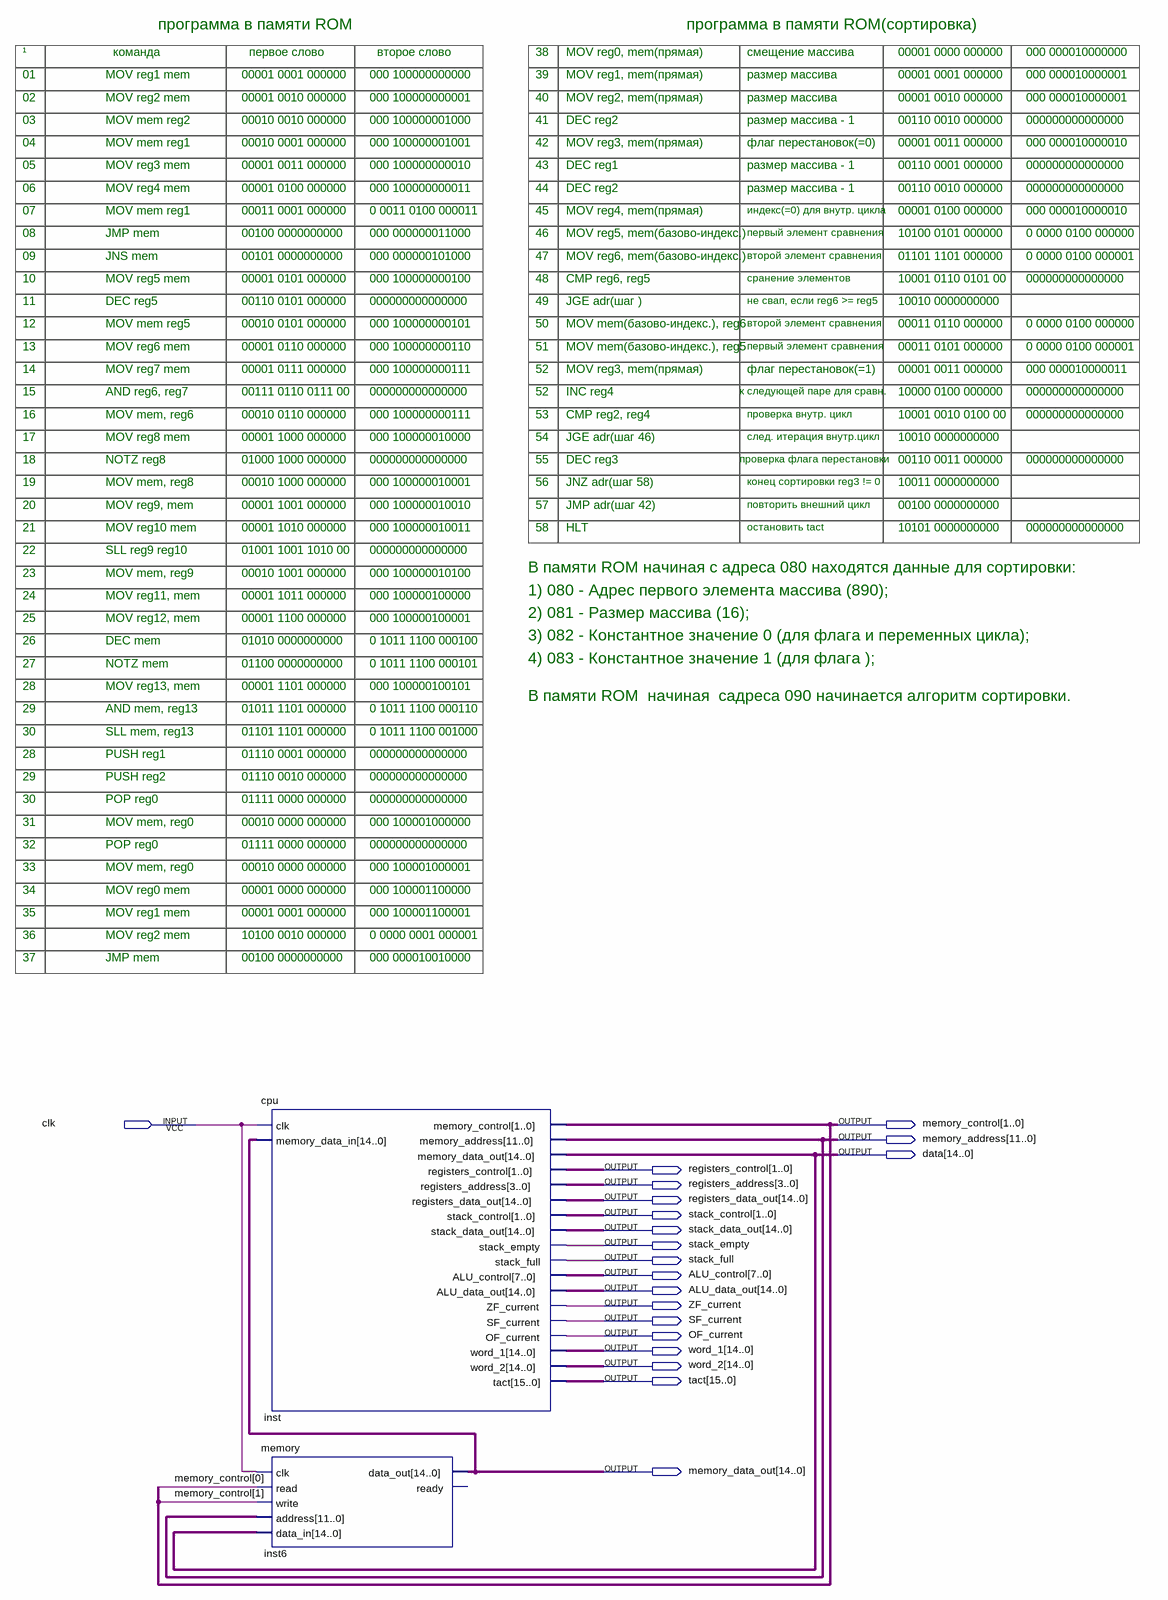
[diagram p0: schematic sheet]
// Quartus schematic principal.bdf as structural Verilog: 2 symbols, 20 pins
module principal (
  input  clk,
  output [1:0] memory_control,
  output [11:0] memory_address,
  output [14:0] data,
  output [1:0] registers_control,
  output [3:0] registers_address,
  output [14:0] registers_data_out,
  output [1:0] stack_control,
  output [14:0] stack_data_out,
  output stack_empty,
  output stack_full,
  output [7:0] ALU_control,
  output [14:0] ALU_data_out,
  output ZF_current,
  output SF_current,
  output OF_current,
  output [14:0] word_1,
  output [14:0] word_2,
  output [15:0] tact,
  output [14:0] memory_data_out
);

  cpu inst (
    .clk(clk), .memory_data_in(memory_data_out), .memory_control(memory_control),
    .memory_address(memory_address), .memory_data_out(data), .registers_control(registers_control),
    .registers_address(registers_address), .registers_data_out(registers_data_out),
    .stack_control(stack_control), .stack_data_out(stack_data_out), .stack_empty(stack_empty),
    .stack_full(stack_full), .ALU_control(ALU_control), .ALU_data_out(ALU_data_out), .ZF_current(ZF_current),
    .SF_current(SF_current), .OF_current(OF_current), .word_1(word_1), .word_2(word_2), .tact(tact));
  memory inst6 (
    .clk(clk), .read(memory_control[0]), .write(memory_control[1]), .address(memory_address), .data_in(data),
    .data_out(memory_data_out));  // open: ready

  // Notes on the sheet:
  //   программа в памяти ROM
  //   программа в памяти ROM(сортировка)
  //   ¹
  //   команда
  //   первое слово
  //   второе слово
  //   38
  //   MOV reg0, mem(прямая)
  //   смещение массива
  //   00001 0000 000000
  //   000 000010000000
  //   01
  //   MOV reg1 mem
  //   00001 0001 000000
  //   000 100000000000
  //   39
  //   MOV reg1, mem(прямая)
  //   размер массива
  //   00001 0001 000000
  //   000 000010000001
  //   02
  //   MOV reg2 mem
  //   00001 0010 000000
  //   000 100000000001
  //   40
  //   MOV reg2, mem(прямая)
  //   размер массива
  //   00001 0010 000000
  //   000 000010000001
  //   03
  //   MOV mem reg2
  //   00010 0010 000000
  //   000 100000001000
  //   41
  //   DEC reg2
  //   размер массива - 1
  //   00110 0010 000000
  //   000000000000000
  //   04
  //   MOV mem reg1
  //   00010 0001 000000
  //   000 100000001001
  //   42
  //   MOV reg3, mem(прямая)
  //   флаг перестановок(=0)
  //   00001 0011 000000
  //   000 000010000010
  //   05
  //   MOV reg3 mem
  //   00001 0011 000000
  //   000 100000000010
  //   43
  //   DEC reg1
  //   размер массива - 1
  //   00110 0001 000000
  //   000000000000000
  //   06
  //   MOV reg4 mem
  //   00001 0100 000000
  //   000 100000000011
  //   44
  //   DEC reg2
  //   размер массива - 1
  //   00110 0010 000000
  //   000000000000000
  //   07
  //   MOV mem reg1
  //   00011 0001 000000
  //   0 0011 0100 000011
  //   45
  //   MOV reg4, mem(прямая)
  //   индекс(=0) для внутр. цикла
  //   00001 0100 000000
  //   000 000010000010
  //   08
  //   JMP mem
  //   00100 0000000000
  //   000 000000011000
  //   46
  //   MOV reg5, mem(базово-индекс.)
  //   первый элемент сравнения
  //   10100 0101 000000
  //   0 0000 0100 000000
  //   09
  //   JNS mem
  //   00101 0000000000
  //   000 000000101000
  //   47
  //   MOV reg6, mem(базово-индекс.)
  //   второй элемент сравнения
  //   01101 1101 000000
  //   0 0000 0100 000001
  //   10
  //   MOV reg5 mem
  //   00001 0101 000000
  //   000 100000000100
  //   48
  //   CMP reg6, reg5
  //   сранение элементов
  //   10001 0110 0101 00
  //   000000000000000
  //   11
  //   DEC reg5
  //   00110 0101 000000
  //   000000000000000
  //   49
  //   JGE adr(шаг )
  //   не свап, если reg6 >= reg5
  //   10010 0000000000
  //   12
  //   MOV mem reg5
  //   00010 0101 000000
  //   000 100000000101
  //   50
  //   MOV mem(базово-индекс.), reg6
  //   второй элемент сравнения
  //   00011 0110 000000
  //   0 0000 0100 000000
  //   13
  //   MOV reg6 mem
  //   00001 0110 000000
  //   000 100000000110
  //   51
  //   MOV mem(базово-индекс.), reg5
  //   первый элемент сравнения
  //   00011 0101 000000
  //   0 0000 0100 000001
  //   14
  //   MOV reg7 mem
  //   00001 0111 000000
  //   000 100000000111
  //   52
  //   MOV reg3, mem(прямая)
  //   флаг перестановок(=1)
  //   00001 0011 000000
  //   000 000010000011
  //   15
  //   AND reg6, reg7
  //   00111 0110 0111 00
  //   000000000000000
  //   52
  //   INC reg4
  //   к следующей паре для сравн.
  //   10000 0100 000000
  //   000000000000000
  //   16
  //   MOV mem, reg6
  //   00010 0110 000000
  //   000 100000000111
  //   53
  //   CMP reg2, reg4
  //   проверка внутр. цикл
  //   10001 0010 0100 00
  //   000000000000000
  //   17
  //   MOV reg8 mem
  //   00001 1000 000000
  //   000 100000010000
  //   54
  //   JGE adr(шаг 46)
  //   след. итерация внутр.цикл
  //   10010 0000000000
  //   18
  //   NOTZ reg8
  //   01000 1000 000000
  //   000000000000000
  //   55
  //   DEC reg3
  //   проверка флага перестановки
  //   00110 0011 000000
  //   000000000000000
  //   19
  //   MOV mem, reg8
  //   00010 1000 000000
  //   000 100000010001
  //   56
  //   JNZ adr(шаг 58)
  //   конец сортировки reg3 != 0
  //   10011 0000000000
  //   20
  //   MOV reg9, mem
  //   00001 1001 000000
  //   000 100000010010
  //   57
  //   JMP adr(шаг 42)
  //   повторить внешний цикл
  //   00100 0000000000
  //   21
  //   MOV reg10 mem
  //   00001 1010 000000
  //   000 100000010011
  //   58
  //   HLT
  //   остановить tact
  //   10101 0000000000
  //   000000000000000
  //   22
  //   SLL reg9 reg10
  //   01001 1001 1010 00
  //   000000000000000
  //   В памяти ROM начиная с адреса 080 находятся данные для сортировки:
  //   23
  //   MOV mem, reg9
  //   00010 1001 000000
  //   000 100000010100
  //   1) 080 - Адрес первого элемента массива (890);
  //   24
  //   MOV reg11, mem
  //   00001 1011 000000
  //   000 100000100000
  //   2) 081 - Размер массива (16);
  //   25
  //   MOV reg12, mem
  //   00001 1100 000000
  //   000 100000100001
  //   3) 082 - Константное значение 0 (для флага и переменных цикла);
  //   26
  //   DEC mem
  //   01010 0000000000
  //   0 1011 1100 000100
  //   4) 083 - Константное значение 1 (для флага );
  //   27
  //   NOTZ mem
  //   01100 0000000000
  //   0 1011 1100 000101
  //   28
  //   MOV reg13, mem
  //   00001 1101 000000
  //   000 100000100101
  //   В памяти ROM  начиная  садреса 090 начинается алгоритм сортировки.
  //   29
  //   AND mem, reg13
  //   01011 1101 000000
  //   0 1011 1100 000110
  //   30
  //   SLL mem, reg13
  //   01101 1101 000000
  //   0 1011 1100 001000
  //   28
  //   PUSH reg1
  //   01110 0001 000000
  //   000000000000000
  //   29
  //   PUSH reg2
  //   01110 0010 000000
  //   000000000000000
  //   30
  //   POP reg0
  //   01111 0000 000000
  //   000000000000000
  //   31
  //   MOV mem, reg0
  //   00010 0000 000000
  //   000 100001000000
  //   32
  //   POP reg0
  //   01111 0000 000000
  //   000000000000000
  //   33
  //   MOV mem, reg0
  //   00010 0000 000000
  //   000 100001000001
  //   34
  //   MOV reg0 mem
  //   00001 0000 000000
  //   000 100001100000
  //   35
  //   MOV reg1 mem
  //   00001 0001 000000
  //   000 100001100001
  //   36
  //   MOV reg2 mem
  //   10100 0010 000000
  //   0 0000 0001 000001
  //   37
  //   JMP mem
  //   00100 0000000000
  //   000 000010010000
endmodule
